# Altium project Airsoft PCB.PrjPcb
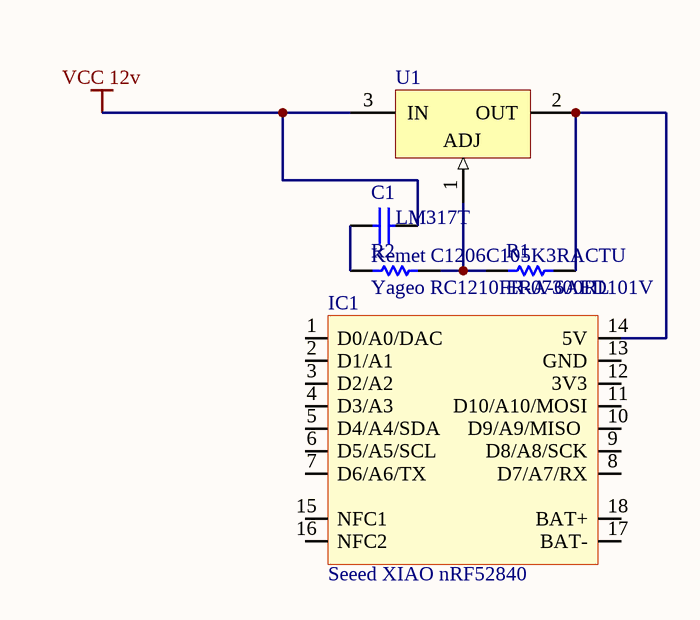
[diagram p0: GotEm.SchDoc]
1 sheet, 5 parts. Net scope: global (net labels, ports and power ports of the same name join across sheets).

## Sheet GotEm.SchDoc
size A; SheetNumber: 1; SheetTotal: 1

### Parts
C1  Kemet C1206C105K3RACTU  [CAPC3216X14N]
IC1  Seeed XIAO nRF52840  [Seeed Studio 102010328-Footprint-1]
R1  ERA-6AED101V  [PCB-tzssradp8ccpgaiuqbqn-1]
R2  Yageo RC1210FR-07300RL  [RESC3126X60X50LL10T20]
U1  LM317T  [TO-220]

### Nets
VCC 12v: C1.2 U1.3(IN)
NetC1_1: C1.1 R2.1
NetIC1_14: IC1.14(5V) R1.2 U1.2(OUT)
NetR1_1: R1.1 R2.2 U1.1(ADJ)

Not connected (* = marked no-connect by the designer): IC1 1(D0/A0/DAC) 2(D1/A1) 3(D2/A2) 4(D3/A3) 5(D4/A4/SDA) 6(D5/A5/SCL) 7(D6/A6/TX) 8(D7/A7/RX) 9(D8/A8/SCK) 10(D9/A9/MISO) 11(D10/A10/MOSI) 12(3V3) 13(GND) 15(NFC1) 16(NFC2) 17(BAT-) 18(BAT+)

### Library data of the parts
C1 = CMP-8752339-3: Capacitor; Ceramic; Cap; 1.00uF; Tol 10%; SMT; Vol-Rtg 25V; High Cap; X7R; Tape And R; Capacitance: 1.00 µF; Voltage Rating (DC): 25.0 V; Case/Package (SI): 3216; Packaging: Cut Tape (CT), Tape & Reel (TR); REACH SVHC Compliance: No SVHC; OctopartID: 9109580191654ece; Dielectric Material: Ceramic; Case/Package: 1206; Dielectric Characteristic: X7R; Octopart URL: http://octopart.com/c1206c105k3ractu-kemet-140554; Size-Length: 3.20 mm; Manufacturer Part Number: C1206C105K3RACTU; Size-Height: 1.60 mm; RoHS: Compliant; Lead-Free Status: R; Mounting Style: Surface Mount; Capacitance Tolerance: ±10%; Footprint: PCB-ogpyxdfq9diinclh3gs0-1; Number of Pins: 2; Size-Width: 1.60 mm
IC1 = CMP-fd93331a820b2254-8: Manufacturer Part Number: 102010448; Manufacturer: Seeed Studio; OctopartID: fd93331a820b2254; Octopart Url: https://octopart.com/102010448-seeed+studio-126049022
R1 = CMP-03b4cbdb4aeddc73-3: Res Thin Film 0805 100 Ohm 0.5% 1/8W Â±25ppm/Â°C Molded SMD SMD Punched Carrier T/R; Power Rating: 125 mW; Resistance: 100 Ω; Lead-Free Status: Lead Free; Case/Package: 0805; Footprint: PCB-d0opi38zsr8l250fp34e-1; Packaging: Reel; Manufacturer Part Number: ERA-6AED101V; RoHS: Compliant; Octopart URL: http://octopart.com/era-6aed101v-panasonic-23424063; Lifecycle Status: Not Listed by Manufacturer; OctopartID: 03b4cbdb4aeddc73
R2 = CMP-7834784-2: Thick Film Resistors - SMD 300 OHM 1%; Lead-Free Status: Lead Free; Resistance: 300.0 Ω; Manufacturer Part Number: RC1210FR-07300RL; Case/Package: 1210; Mounting Style: Surface Mount; Octopart Url: https://octopart.com/rc1210fr-07300rl-yageo-22251984; OctopartID: 9fc3579a33754004; Resistance Tolerance: ±1%; RoHS: Compliant
U1 = CMP-e7a82ea31263386f-1: Adjustable Positive Standard Regulator, 1.2V Min, 37V Max, BIPolar, PSFM3; Output Current: 2.20 A; Number of Outputs: 1; Output Voltage: 1.20 V (min), 37.0 V (max); Operating Temperature: 0.00 °C (min); Manufacturer Part Number: LM317T; Number of Pins: 3; OctopartID: e7a82ea31263386f; RoHS: Compliant; Octopart Url: https://octopart.com/lm317t-nte+electronics-118957